# Altium schematic sheet RS485.SchDoc: RS485
size A4; Revision: 1; SheetNumber: 7; SheetSize: A4
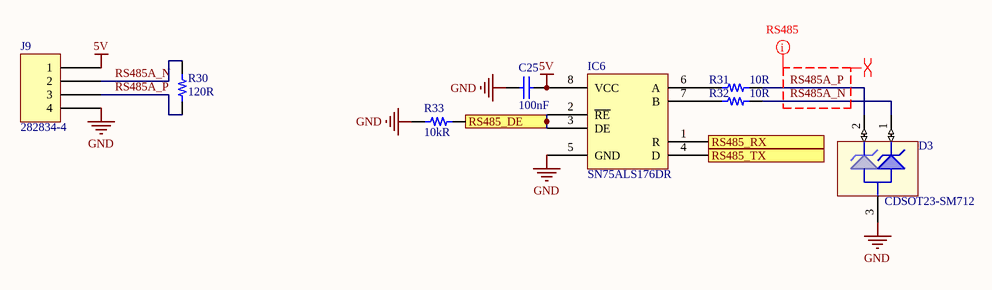
[diagram p0: RS485.SchDoc]

## Parts
C25  100nF  [CAP 0603/1608]
D3  CDSOT23-SM712  [sc70-3]
IC6  SN75ALS176DR  [TI SOIC-8 D]
J9  282834-4  [TE 282834-4]  (no BOM)
R30  120R  [RES 0603/1608]
R31  10R  [RES 0603/1608]
R32  10R  [RES 0603/1608]
R33  10kR  [RES 0603/1608]

## Ports
RS485_DE (in), RS485_RX (out), RS485_TX (in)

## Nets
5V: C25.2 IC6.8(VCC) J9.1
GND: C25.1 D3.3 IC6.5(GND) J9.4 R33.2
RS485_DE: IC6.2(~{RE}) IC6.3(DE) R33.1 ; port RS485_DE
RS485_RX: IC6.1(R) ; port RS485_RX
RS485_TX: IC6.4(D) ; port RS485_TX
RS485A_N: D3.1 J9.2 R30.2 R32.2
RS485A_P: D3.2 J9.3 R30.1 R31.2
NetIC6_6: IC6.6(A) R31.1
NetIC6_7: IC6.7(B) R32.1

## Layout directives
differential pair; differential pair class RS485A: RS485A_N, RS485A_P
net class RS485A: RS485A_N, RS485A_P

## Notes on the sheet
- Title:
- Size:
- Project:
- Revision:
- Sheet
- of
- Date:
- YıLDıZ IoT
- Elperek Mahallesi
- Saray Sokak, No:12
- SAKARYA / TURKEY
- File:

## Library data of the parts
C25 = Cap - Ceramic: Capacitor, Ceramic; Manufacturer: Samsung; Manufacturer Part Number: CL10A104KA8NNNC; Tolerance: 10%; Voltage Rating: 25V; Dielectric: X5R; Supplier 1: Digi-Key; Supplier Part Number 1: 1276-1857-1-ND; Stock 1: 978306; Pricing 1: 1 = 0,10000, 10 = 0,04600, 100 = 0,02070, 500 = 0,01478, 1000 = 0,01162 (USD); RoHS: Yes; Mount: Surface Mount; Case/Package: 0603; Case Code (Metric): 1608; Case Code (Imperial): 0603; Contact Plating: Tin; Min Operating Temperature: -55°C; Max Operating Temperature: 85°C; Package Quantity: 1; Packaging: Tape and Reel; Capacitance: 100nF; Voltage Rating (DC): 25V; Termination: Wraparound; Length: 0.063inch; Width: 0.031inch; Thickness: 0.035inch; Lead Free: Lead Free; ComponentLink1URL: http://www.samsungsem.com/kr/support/library/product-catalog/mlcc.jsp; ComponentLink1Description: http://www.samsungsem.com/kr/support/library/product-catalog/mlcc.jsp; Price: 0,1
D3 = TVS Array: Dual-line Transil™,  transient voltage suppressor (TVS); Manufacturer: Bourns; Direction: Bidirectional; Capacitance: 75pF; Max Surge Current: 30A; Number of Elements: 2; Reverse Breakdown Voltage: 13.3V; Polarity: Bidirectional,Unidirectional; Clamping Voltage: 26V; Max Power Dissipation: 600W; Working Voltage: 12V; Peak Pulse Power: 400W; Power Line Protection: No; Leakage Current: 20uA; ESD Protection: Yes; Peak Pulse Current: 17A; Test Current: 1mA; Element Configuration: Dual; Supplier 1: Digi-Key; Supplier Part Number 1: CDSOT23-SM712CT-ND; Manufacturer Part Number: CDSOT23-SM712; Stock 1: 158124; Pricing 1: 1 = 1,70000, 10 = 1,50900, 25 = 1,36280, 100 = 1,19240, 250 = 1,04636, 500 = 0,92468, 1000 = 0,73001 (USD); RoHS: Yes; Mount: Surface Mount; Case/Package: SOT-23; Number of Pins: 3; Contact Plating: Tin; Min Operating Temperature: -55°C; Max Operating Temperature: 150°C; Packaging: Tape and Reel; Package Quantity: 1; Number of Channels: 2; Breakdown Voltage: 13.3V; Termination: SMD/SMT; Number of Bidirectional Channels: 2; Reverse Standoff Voltage: 12V; Min Breakdown Voltage: 13.3V; Power Dissipation: 400W; Max Reverse Leakage Current: 20uA; Max Breakdown Voltage: 13.3V; Composition: Zener; Length: 3.04mm; Height: 1.11mm; Width: 0.055inch; Depth: 1.4mm; Radiation Hardening: No; REACH SVHC: No SVHC; ComponentLink1URL: http://www.farnell.com/datasheets/2645121.pdf; ComponentLink1Description: http://www.farnell.com/datasheets/2645121.pdf; ComponentLink2URL: http://www.bourns.com/docs/Product-Datasheets/CDSOT23-SM712.pdf; ComponentLink2Description: http://www.bourns.com/docs/Product-Datasheets/CDSOT23-SM712.pdf; ComponentLink3URL: https://www.bourns.com/docs/technical-documents/technical-library/circuit-protection/design-notes/bourns_rs485_evalboard4_design_note.pdf; ComponentLink3Description: https://www.bourns.com/docs/technical-documents/technical-library/circuit-protection/design-notes/bourns_rs485_evalboard4_design_note.pdf; ComponentLink4URL: http://www.farnell.com/datasheets/1670933.pdf; ComponentLink4Description: http://www.farnell.com/datasheets/1670933.pdf
IC6 = SN65HVD78DR: IC TRANSCEIVER HALF 1/1 8SOIC; Manufacturer: Texas Instruments; Data Rate: 35Mbps; Max Supply Voltage: 5.25V; Min Supply Voltage: 4.75V; Number of Drivers: 1; Operating Supply Current: 30mA; Simplex/Duplex: Half Duplex; ESD Protection: No; Operating Supply Voltage: 5V; ComponentLink1Description: Datasheet; ComponentLink1URL: http://www.ti.com/general/docs/suppproductinfo.tsp?distId=10&gotoUrl=http%3A%2F%2Fwww.ti.com%2Flit%2Fgpn%2Fsn65hvd78; ComponentLink2Description: DigiKey Link; ComponentLink2URL: http://digikey.com/product-detail/en/texas-instruments/SN65HVD78DR/296-36714-1-ND/4341340; ComponentLink3URL: https://datasheet.ciiva.com/26837/sn75als176dr-26837272.pdf?src-supplier=IIIC; ComponentLink3Description: https://datasheet.ciiva.com/26837/sn75als176dr-26837272.pdf?src-supplier=IIIC; ComponentLink4URL: https://datasheet.ciiva.com/14427/sn75als176a-14427911.pdf?src-supplier=Avnet; ComponentLink4Description: https://datasheet.ciiva.com/14427/sn75als176a-14427911.pdf?src-supplier=Avnet; ComponentLink5URL: https://datasheet.ciiva.com/1703/sn65als176-1703130.pdf?src-supplier=Digi-Key; ComponentLink5Description: https://datasheet.ciiva.com/1703/sn65als176-1703130.pdf?src-supplier=Digi-Key; ComponentLink6URL: https://datasheet.ciiva.com/1703/sn65als176-1703132.pdf?src-supplier=Digi-Key; ComponentLink6Description: https://datasheet.ciiva.com/1703/sn65als176-1703132.pdf?src-supplier=Digi-Key; ComponentLink7URL: https://datasheet.ciiva.com/1703/sn65als176-1703131.pdf?src-supplier=Digi-Key; ComponentLink7Description: https://datasheet.ciiva.com/1703/sn65als176-1703131.pdf?src-supplier=Digi-Key; ComponentLink8URL: https://datasheet.ciiva.com/48707/001048080-da-01-en-ic-dff-bus-tvr-s-sn75als176dr-soic-8-tid-48707959.pdf?src-supplier=Conrad; ComponentLink8Description: https://datasheet.ciiva.com/48707/001048080-da-01-en-ic-dff-bus-tvr-s-sn75als176dr-soic-8-tid-48707959.pdf?src-supplier=Conrad; Supplier 1: Digi-Key; Supplier Part Number 1: 296-14966-1-ND; Manufacturer Part Number: SN75ALS176DR; Stock 1: 2500; Pricing 1: 1 = 0,99000, 10 = 0,88500, 25 = 0,84000, 100 = 0,69000, 250 = 0,64500, 500 = 0,57000, 1000 = 0,45000 (USD); RoHS: Yes; Case/Package: D; Number of Pins: 8; Weight: 0.002561oz; Contact Plating: Gold; Min Operating Temperature: 0°C; Max Operating Temperature: 70°C; Logic Function: Transceiver; Number of Transceivers: 1; Max Supply Current: 30mA; Number of Receivers: 1; Number of Transmitters: 1; Nominal Supply Current: 30mA; Packaging: Tape and Reel; Package Quantity: 1; Length: 4.9mm; Height: 1.58mm; Width: 3.91mm; Radiation Hardening: No; Lead Free: Lead Free
J9 = 282834-4: TERM BLK 4P SIDE ENT 2.54MM PCB; Manufacturer: TE Connectivity AMP Connectors; Current: 10A; Mating Orientation: Horizontal with Board; Number of Levels: 1; Pitch: 0.100" (2.54mm); Positions Per Level: 4; Voltage: 150V; Wire Gauge: 16-30 AWG; Wire Termination: Screw - Rising Cage Clamp; Part Number: 282834-4; Color: Green; ComponentLink1Description: Datasheet; ComponentLink1URL: https://www.te.com/commerce/DocumentDelivery/DDEController?Action=srchrtrv&DocNm=282834&DocType=Customer+Drawing&DocLang=English; ComponentLink2Description: DigiKey Link; ComponentLink2URL: http://digikey.com/product-detail/en/te-connectivity-amp-connectors/282834-4/A98335-ND/1153265; LastUpdated: 15.01.2020 04:16:05; Lifecycle Status: Active; Minimum Order: 1; Mounting Type: Through Hole; Packaging: Bulk; Part Status: Active; Price: 2.68; Series: Buchanan; Supplier 1: DigiKey; Supplier Part Number 1: A98335-ND
R30 = Resistor_Chip: Ceramic, SMT Capacitor; Manufacturer: Susumu; Manufacturer Part Number: RR0816P-121-D; Power Rating: 63mW; Tolerance: 0.5%; Voltage Rating: 75V; Temperature Coefficient: 25ppm/°C; Supplier 1: Digi-Key; Supplier Part Number 1: RR08P120DCT-ND; Stock 1: 6882; Pricing 1: 1 = 0,11000, 10 = 0,09800, 100 = 0,03760, 1000 = 0,01654, 2500 = 0,01428 (USD); RoHS: Yes; Case/Package: 0603; Number of Pins: 2; Case Code (Metric): 1608; Case Code (Imperial): 0603; Min Operating Temperature: -55°C; Max Operating Temperature: 125°C; Package Quantity: 1; Resistance: 120R; Packaging: Tape and Reel; Composition: Thin Film; Number of Terminations: 2; Termination: SMD/SMT; Max Power Dissipation: 63mW; Voltage Rating (DC): 75V; Length: 0.063inch; Height: 0.02inch; Width: 0.032inch; Depth: 0.8mm; Height - Seated (Max): 0.02inch; REACH SVHC: Unknown; Lead Free: Lead Free; ComponentLink1URL: http://www.susumu.co.jp/common/pdf/n_catalog_partition05_en.pdf; ComponentLink1Description: http://www.susumu.co.jp/common/pdf/n_catalog_partition05_en.pdf; ComponentLink2URL: http://documents.rs-components.com/techlib://itc_doclist_GB.htm?stockno=4744287; ComponentLink2Description: http://documents.rs-components.com/techlib://itc_doclist_GB.htm?stockno=4744287
R31 R32 = Resistor_Chip: Ceramic, SMT Capacitor; Manufacturer: Rohm; Manufacturer Part Number: ESR03EZPJ100; Supplier 1: Digi-Key; Supplier Part Number 1: RHM10DCT-ND; Stock 1: 70067; Pricing 1: 1 = 0,10000, 10 = 0,08700, 100 = 0,03330, 1000 = 0,01464, 2500 = 0,01264 (USD); RoHS: Yes; Case/Package: 0603; Resistance: 10R
R33 = Resistor_Chip: Ceramic, SMT Capacitor; Manufacturer: Stackpole Electronics; Manufacturer Part Number: RNCP0603FTD10K0; Tolerance: 1%; Max Power Dissipation: 125mW; Temperature Coefficient: 100ppm/°C; Supplier 1: Digi-Key; Supplier Part Number 1: RNCP0603FTD10K0CT-ND; Stock 1: 183083; Pricing 1: 1 = 0,10000, 10 = 0,06700, 100 = 0,02730, 1000 = 0,01224, 2500 = 0,01063 (USD); RoHS: Yes; Mount: Surface Mount; Case/Package: 0603; Case Code (Metric): 1608; Case Code (Imperial): 0603; Contact Plating: Matte,Tin; Min Operating Temperature: -55°C; Max Operating Temperature: 155°C; Packaging: Tape and Reel; Resistance: 10kR; Composition: Thin Film; Number of Terminations: 2; Features: Anti-Sulfur,Moisture Resistant; Length: 0.059inch; Height: 0.02inch; Width: 0.031inch; Radiation Hardening: No; Lead Free: Lead Free